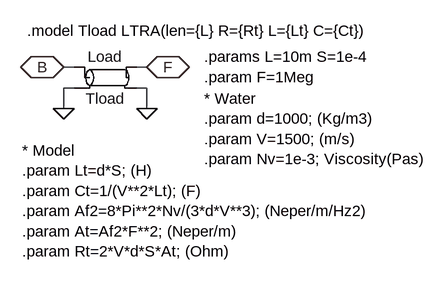
[diagram p0: schematic SubstFin.asc]
SubstFin.asc, the LTspice schematic file:
Version 4
SHEET 1 1424 680
WIRE 256 -96 240 -96
WIRE 368 -96 352 -96
WIRE 256 -64 240 -64
WIRE 368 -64 352 -64
WIRE 240 -32 240 -64
WIRE 368 -32 368 -64
FLAG 240 -96 B
IOPIN 240 -96 BiDir
FLAG 368 -96 F
IOPIN 368 -96 BiDir
FLAG 240 -32 0
FLAG 368 -32 0
SYMBOL ltline 304 -80 R0
SYMATTR InstName Load
SYMATTR Value Tload
TEXT 184 -152 Left 0 !.model Tload LTRA(len={L} R={Rt} L={Lt} C={Ct})
TEXT 456 -48 Left 0 !* Water\n.param d=1000; (Kg/m3)\n.param V=1500; (m/s)\n.param Nv=1e-3; Viscosity(Pas)
TEXT 176 32 Left 0 !* Model\n.param Lt=d*S; (H) \n.param Ct=1/(V**2*Lt); (F)\n.param Af2=8*Pi**2*Nv/(3*d*V**3); (Neper/m/Hz2)\n.param At=Af2*F**2; (Neper/m)\n.param Rt=2*V*d*S*At; (Ohm)
TEXT 456 -112 Left 0 !.params L=10m S=1e-4 \n.param F=1Meg

The netlist it stands for:
* SubstFin.asc
O§Load B 0 F 0 Tload
.model Tload LTRA(len={L} R={Rt} L={Lt} C={Ct})
* Water
.param d=1000; (Kg/m3)
.param V=1500; (m/s)
.param Nv=1e-3; Viscosity(Pas)
* Model
.param Lt=d*S; (H)
.param Ct=1/(V**2*Lt); (F)
.param Af2=8*Pi**2*Nv/(3*d*V**3); (Neper/m/Hz2)
.param At=Af2*F**2; (Neper/m)
.param Rt=2*V*d*S*At; (Ohm)
.params L=10m S=1e-4
.param F=1Meg
.backanno
.end